# Altium schematic sheet Connectors.SchDoc
size A4; SheetNumber: 3; SheetTotal: 5
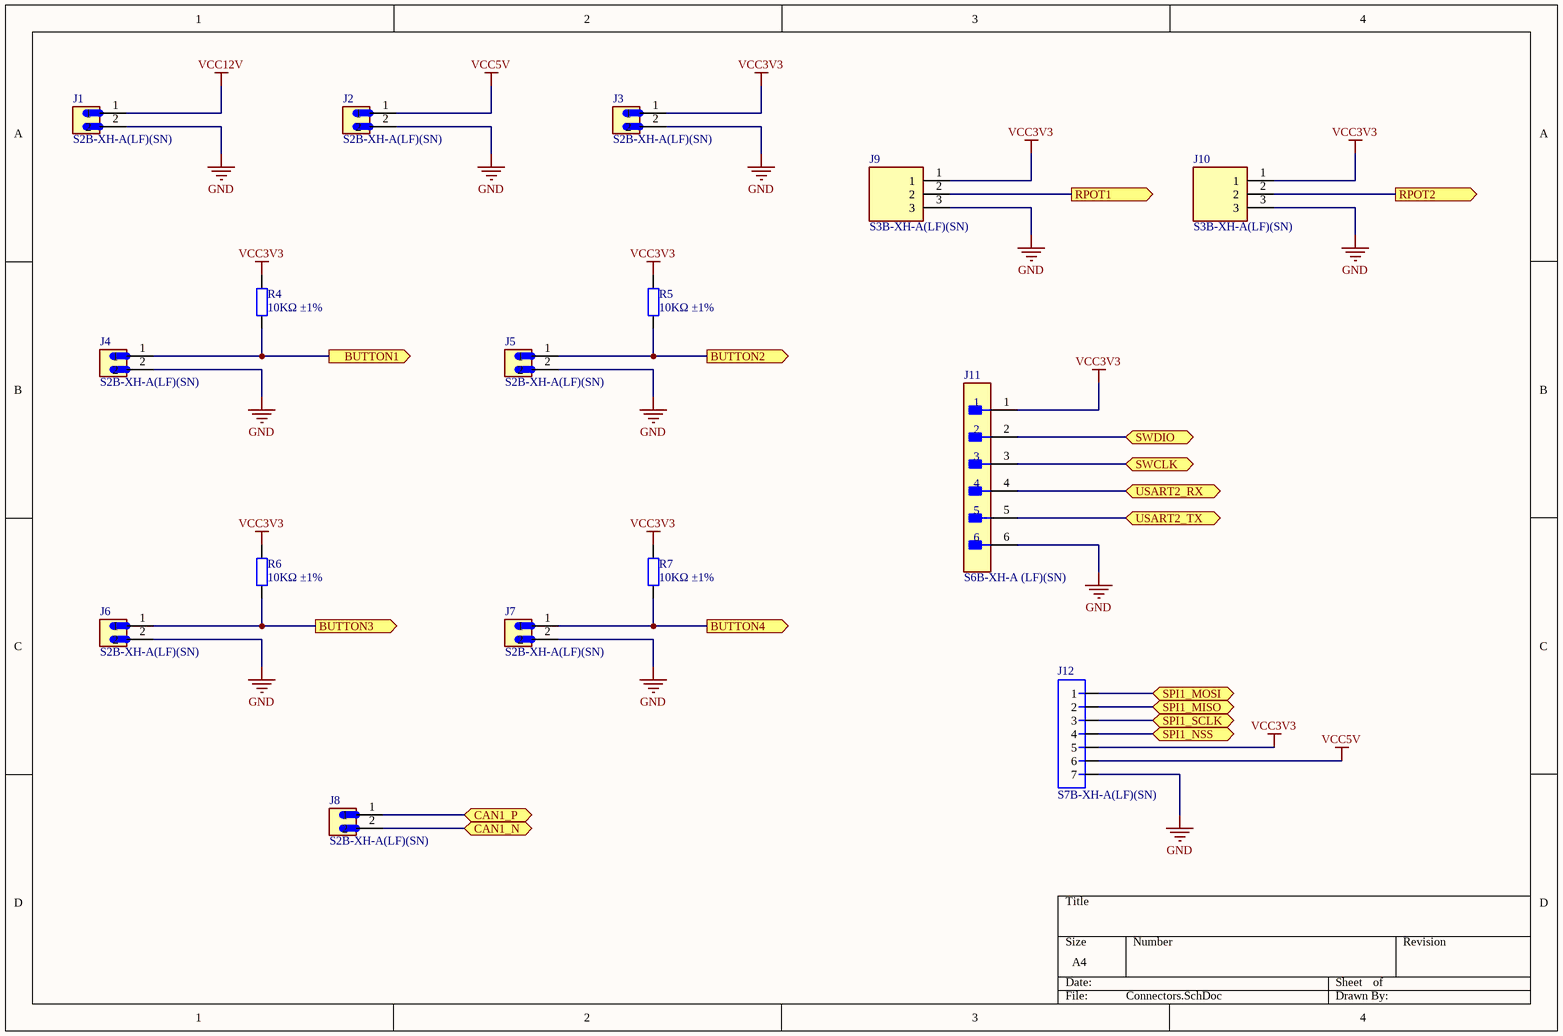
[diagram p0: Connectors.SchDoc]

## Parts
J1  S2B-XH-A(LF)(SN)  [JST_S2B-XH-A(LF)(SN)]
J2  S2B-XH-A(LF)(SN)  [JST_S2B-XH-A(LF)(SN)]
J3  S2B-XH-A(LF)(SN)  [JST_S2B-XH-A(LF)(SN)]
J4  S2B-XH-A(LF)(SN)  [JST_S2B-XH-A(LF)(SN)]
J5  S2B-XH-A(LF)(SN)  [JST_S2B-XH-A(LF)(SN)]
J6  S2B-XH-A(LF)(SN)  [JST_S2B-XH-A(LF)(SN)]
J7  S2B-XH-A(LF)(SN)  [JST_S2B-XH-A(LF)(SN)]
J8  S2B-XH-A(LF)(SN)  [JST_S2B-XH-A(LF)(SN)]
J9  S3B-XH-A(LF)(SN)  [JST_S3B-XH-A(LF)(SN)]
J10  S3B-XH-A(LF)(SN)  [JST_S3B-XH-A(LF)(SN)]
J11  S6B-XH-A (LF)(SN)  [FP-S6B-XH-A_LF_SN-MFG]
J12  S7B-XH-A(LF)(SN)  [JST_S7B-XH-A(LF)(SN)]
R4  10KΩ ±1%  [0402_R]
R5  10KΩ ±1%  [0402_R]
R6  10KΩ ±1%  [0402_R]
R7  10KΩ ±1%  [0402_R]

## Ports
BUTTON1 (out, see Top[2B], MCU[5C]), BUTTON2 (out, see Top[2B], MCU[5C]), BUTTON3 (out, see Top[2B], MCU[5B]), BUTTON4 (out, see Top[2B], MCU[5C]), CAN1_N (bidir, see Top[2B], CAN[3B], MCU[6B]), CAN1_P (bidir, see Top[2B], CAN[3B], MCU[6B]), RPOT1 (out, see Top[2B], MCU[5B]), RPOT2 (out, see Top[2B], MCU[5B]), SPI1_MISO (bidir, see Top[2B], MCU[5A]), SPI1_MOSI (bidir, see Top[2B], MCU[5A]), SPI1_NSS (bidir, see Top[2A], MCU[5A]), SPI1_SCLK (bidir, see Top[2B], MCU[5A]), SWCLK (bidir, see Top[2B], MCU[5B]), SWDIO (bidir, see Top[2B], MCU[5B]), USART2_RX (bidir, see Top[2B], MCU[5A]), USART2_TX (bidir, see Top[2B], MCU[5A])

## Nets
GND: J1.2 J2.2 J3.2 J4.2 J5.2 J6.2 J7.2 J9.3 J10.3 J11.6 J12.7
VCC3V3: J3.1 J9.1 J10.1 J11.1 J12.5 R4.2 R5.2 R6.2 R7.2
VCC5V: J2.1 J12.6
VCC12V: J1.1
BUTTON1: J4.1 R4.1 ; port BUTTON1
BUTTON2: J5.1 R5.1 ; port BUTTON2
BUTTON3: J6.1 R6.1 ; port BUTTON3
BUTTON4: J7.1 R7.1 ; port BUTTON4
CAN1_N: J8.2 ; port CAN1_N
CAN1_P: J8.1 ; port CAN1_P
RPOT1: J9.2 ; port RPOT1
RPOT2: J10.2 ; port RPOT2
SPI1_MISO: J12.2 ; port SPI1_MISO
SPI1_MOSI: J12.1 ; port SPI1_MOSI
SPI1_NSS: J12.4 ; port SPI1_NSS
SPI1_SCLK: J12.3 ; port SPI1_SCLK
SWCLK: J11.3 ; port SWCLK
SWDIO: J11.2 ; port SWDIO
USART2_RX: J11.4 ; port USART2_RX
USART2_TX: J11.5 ; port USART2_TX

## Library data of the parts
J1-J8 = S2B-XH-A(LF)(SN): Connector Header Through Hole, Right Angle 2 position 0.098 (2.50mm); MF: JST Sales; Purchase-URL: https://pricing.snapeda.com/search/part/S2B-XH-A(LF)(SN)/?ref=eda; Digi-Key_Part_Number: 455-2257-ND; Package: None; Check_prices: https://www.snapeda.com/parts/S2B-XH-A(LF)(SN)/JST+Sales+America+Inc./view-part/?ref=eda; Value: *; SnapEDA_Link: https://www.snapeda.com/parts/S2B-XH-A(LF)(SN)/JST+Sales+America+Inc./view-part/?ref=snap; MP: S2B-XH-A(LF)(SN)
J9 J10 = S3B-XH-A(LF)(SN): CONN, R/A HEADER, 3POS, 1ROW, 2.5MM; Connector Systems:Wire-to-Board; Pitch Spacing:2.5mm; No. of Rows:1Rows; No. of Contacts:3Contacts; Contact Termination Type:Through Hole Right Angle; Product Range:XH Series RoHS Compliant: Yes; MF: JST; Purchase-URL: https://pricing.snapeda.com/search/part/S3B-XH-A (LF)(SN)/?ref=eda; Check_prices: https://www.snapeda.com/parts/S3B-XH-A%20(LF)(SN)/JST/view-part/?ref=eda; SnapEDA_Link: https://www.snapeda.com/parts/S3B-XH-A%20(LF)(SN)/JST/view-part/?ref=snap; Price: None; Availability: In Stock; Package: None; MP: S3B-XH-A (LF)(SN); Value: *
J11 = CMP-17439-000165-2: CONN HEADER R/A 6POS 2.5MM; Number of Contacts: 6; Contact Resistance: 20mR; Max Current Rating: 3A; Max Voltage Rating (AC): 250V; Gender: Male; Insulation Resistance: 1GR; Wire/Cable Gauge: 22AWG; Fastening Type: Detent; Lead Pitch: 2.5mm; Flammability Rating: UL94 V-0; Contact Finish - Mating: TIN; Housing Material: Polyamide; Length: 17.4mm; Termination: Solder; Contact Type: Male Pin; Number of Positions: 6; Mount: Through Hole; Orientation: Right Angle; Voltage Rating (AC): 250V; Contact Shape: Square; Lead Free: Lead Free; Insulation Material: Nylon; Insulation Color: Natural; Contact Plating: Tin; Connector Type: Header; Housing Color: White; Color: Natural; Package Quantity: 500; Contact Material: Brass; Packaging: Bulk; Pitch: 2.5mm; Series: XH; Number of Rows: 1; Min Operating Temperature: -25°C; Voltage Rating: 250V; REACH SVHC: No SVHC; Current Rating: 3A; Depth: 11.5mm; Max Operating Temperature: 85°C
J12 = S7B-XH-A(LF)(SN): Connector Header Through Hole, Right Angle 7 position 0.098 _2.50mm_; MP: S7B-XH-A_LF__SN_; MF: JST Sales; SnapEDA_Link: https://www.snapeda.com/parts/S7B-XH-A%28LF%29%28SN%29/JST%20Sales%20America%20Inc./view-part/2768211/?ref=snap; Availability: Unavailable; Package: None; Value: *; Price: None
R4-R7 = 0402 10K (1002) 1%: Chip resistor; Manufacturer: Uniroyal Elec; PartNumber: 0402WGF1002TCE; Power: 1/16W; ComponentLink1Description: Supplier link; ComponentLink1URL: http://www.szlcsc.com/product/details_26487.html; Package: 0402; Supplier: LC; SuppliersPartNumber: C25744; Resistance: 10KΩ; Tolerance: 1%